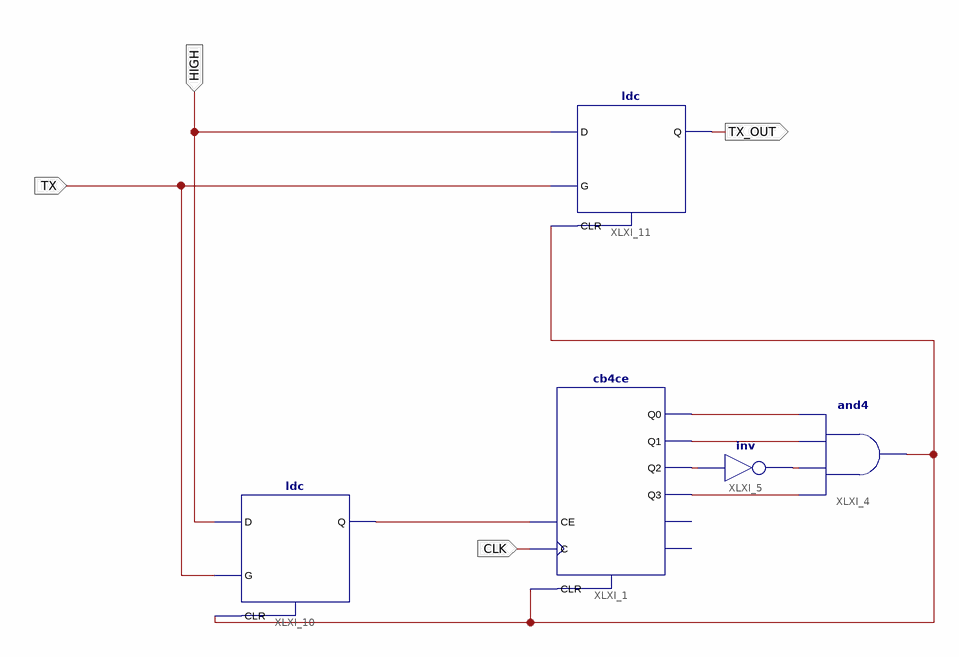
[diagram p0: schematic sheet 1]
// Xilinx ISE schematic NeW_LOGIC_INPUT.sch (spartan3e) as structural Verilog: 5 symbols, 4 ports
module NeW_LOGIC_INPUT (
  input  CLK,
  input  TX,
  input  HIGH,
  output TX_OUT
);

  wire RESET, XLXN_1, XLXN_2, XLXN_3, XLXN_4, XLXN_5, XLXN_14;

  cb4ce XLXI_1 (
    .C(CLK), .CE(XLXN_14), .CLR(RESET), .Q0(XLXN_1), .Q1(XLXN_2), .Q2(XLXN_3), .Q3(XLXN_5));  // open: CEO, TC
  and XLXI_4 (RESET, XLXN_5, XLXN_4, XLXN_2, XLXN_1);
  not XLXI_5 (XLXN_4, XLXN_3);
  ldc XLXI_10 (.CLR(RESET), .D(HIGH), .G(TX), .Q(XLXN_14));
  ldc XLXI_11 (.CLR(RESET), .D(HIGH), .G(TX), .Q(TX_OUT));
endmodule
